# EAGLE design PowerMonitorV2 (EAGLE 8.6.0)
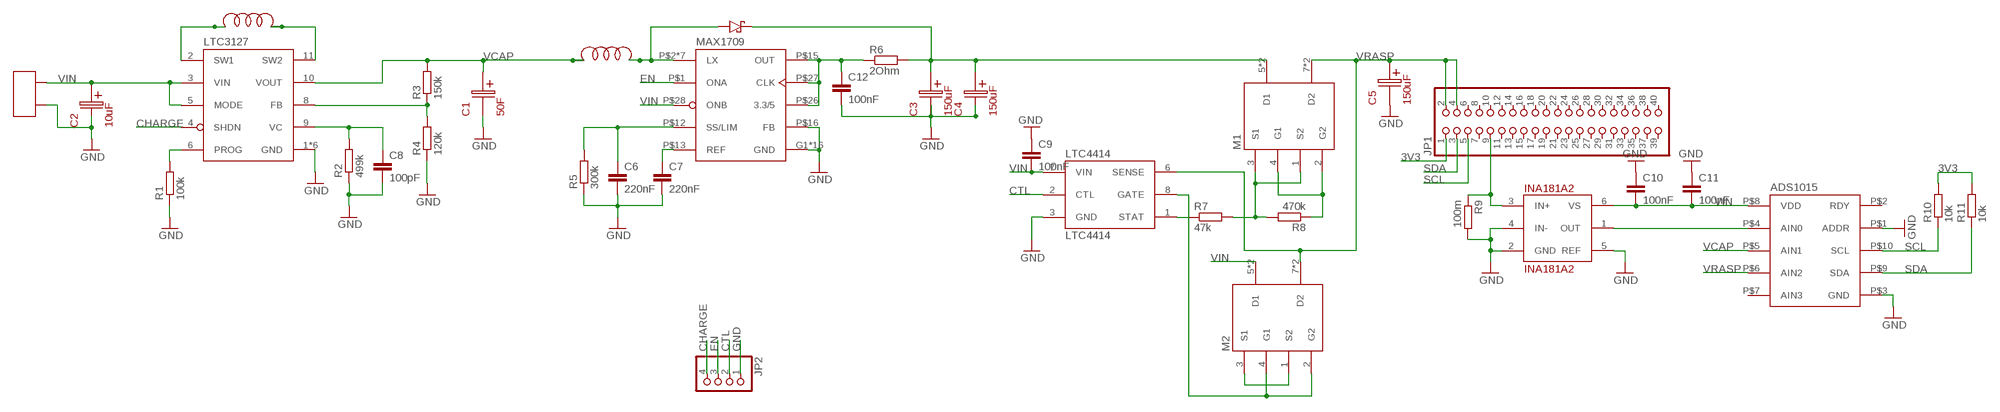
[diagram p0: schematic, sheet 1]

## Parts
ADS1015  ADS1015  [VSSOP-10]
C1  50F  CAPACITOR8MM50F_SUPERCAP  [CAP_RAD_8MM]
C2  10uF  CAPACITOR2.5MM  [CAP_RAD_2.5MM]
C3  150uF  CAPACITOR3.5MM  [CAP_RAD_3.5MM]
C4  150uF  CAPACITOR3.5MM  [CAP_RAD_3.5MM]
C5  150uF  CAPACITOR3.5MM  [CAP_RAD_3.5MM]
C6  220nF  C-EUC0805  [C0805]
C7  220nF  C-EUC0805  [C0805]
C8  100pF  C-EUC0805  [C0805]
C9  100nF  C-EUC0805  [C0805]
C10  100nF  C-EUC0805  [C0805]
C11  100nF  C-EUC0805  [C0805]
C12  100nF  C-EUC0805  [C0805]
CON1  TERM-2  [TERM-2]
D1  STPS8L30_DPAK  [DPAK]
INA181A2  INA181A2  [SOT-23-6]
JP1  PINHD-2X20  [2X20]
JP2  PINHD-1X4/90  [1X04/90]
L1  4.7uH  INDUCTOR6MM  [IND6X6]
L2  1uH  INDUCTOR6MM  [IND6X6]
LTC3127  LTC3127  [MS-12E2]
LTC4414  LTC4414  [MS8]
M1  IRF9358PBF  [SO-8]
M2  IRF9358PBF  [SO-8]
MAX1709  MAX1709  [TSSOP-EP28]
R1  100k  R-EU_R0805  [R0805]
R2  499k  R-EU_R0805  [R0805]
R3  150k  R-EU_R0805  [R0805]
R4  120k  R-EU_R0805  [R0805]
R5  300k  R-EU_R0805  [R0805]
R6  2Ohm  R-EU_R0805  [R0805]
R7  47k  R-EU_R0805  [R0805]
R8  470k  R-EU_R0805  [R0805]
R9  100m  R-EU_R0805  [R0805]
R10  10k  R-EU_R0805  [R0805]
R11  10k  R-EU_R0805  [R0805]

## Nets
3V3: JP1.1 R10.2 R11.2
BOOSTCAP: C3.VCAP(V+) C4.VCAP(V+) D1.P$1(CATHODE) D1.P$1_0(CATHODE) D1.P$1_1(CATHODE) D1.P$1_2(CATHODE) D1.P$1_3(CATHODE) D1.P$1_4(CATHODE) D1.P$1_5(CATHODE) D1.P$1_6(CATHODE) D1.P$1_7(CATHODE) D1.P$1_8(CATHODE) D1.P$1_9(CATHODE) M1.5(D1) M1.6(D1) R6.2
CHARGE: JP2.4 LTC3127.4(SHDN)
CTL: JP2.2 LTC4414.2(CTL)
EN: JP2.3 MAX1709.P$1(ONA)
GATECAP: M1.2(G2) M1.4(G1) R8.1
GATEVIN: LTC4414.8(GATE) M2.2(G2) M2.4(G1)
GND: ADS1015.P$1(ADDR) ADS1015.P$3(GND) C1.GND(V-) C2.GND(V-) C3.GND(V-) C4.GND(V-) C5.GND(V-) C6.2 C7.2 C8.2 C9.1 C10.1 C11.1 C12.2 CON1.2 INA181A2.2(GND) INA181A2.4(IN-) INA181A2.5(REF) JP2.1 LTC3127.1(GND) LTC3127.7(GND) LTC3127.12(GND) LTC3127.13_0(GND) LTC3127.13_1(GND) LTC3127.13_2(GND) LTC4414.3(GND) MAX1709.G1(GND) MAX1709.G2(GND) MAX1709.G3(GND) MAX1709.G4(GND) MAX1709.G5(GND) MAX1709.G6(GND) MAX1709.G7(GND) MAX1709.G8(GND) MAX1709.P$11(GND) MAX1709.P$14(GND) MAX1709.P$16(FB) MAX1709.P$18(GND) MAX1709.P$19(GND) MAX1709.P$20(GND) MAX1709.P$21(GND) MAX1709.P$22(GND) MAX1709.P$23(GND) R1.1 R2.1 R4.1 R5.1 R9.2
GNDPI: INA181A2.3(IN+) JP1.9 R9.1
N$1: C7.1 MAX1709.P$13(REF)
N$7: LTC3127.6(PROG) R1.2
N$9: C8.1 LTC3127.9(VC) R2.2
N$10: LTC3127.8(FB) R3.1 R4.2
N$12: M1.1(S2) M1.3(S1) R7.2 R8.2
N$13: C6.1 MAX1709.P$12(SS/LIM) R5.2
N$15: M2.1(S2) M2.3(S1)
N$19: C12.1 MAX1709.P$15(OUT) MAX1709.P$26(3.3/5) MAX1709.P$27(CLK) R6.1
N$22: LTC4414.1(STAT) R7.1
SCL: ADS1015.P$10(SCL) JP1.5 R10.1
SDA: ADS1015.P$9(SDA) JP1.3 R11.1
SW1_1: L1.P$1 L1.P$3 L1.P$4 LTC3127.2(SW1)
SW1_2: L1.P$2 L1.P$5 L1.P$6 LTC3127.11(SW2)
SW2: D1.P$2(ANODE) L2.P$2 L2.P$5 L2.P$6 MAX1709.P$2(LX) MAX1709.P$3(LX) MAX1709.P$4(LX) MAX1709.P$5(LX) MAX1709.P$6(LX) MAX1709.P$7(LX) MAX1709.P$8(LX)
VCAP: ADS1015.P$5(AIN1) C1.VCAP(V+) L2.P$1 L2.P$3 L2.P$4 LTC3127.10(VOUT) R3.2
VCURRENT: ADS1015.P$4(AIN0) INA181A2.1(OUT)
VIN: ADS1015.P$8(VDD) C2.VCAP(V+) C9.2 C10.2 C11.2 CON1.1 INA181A2.6(VS) LTC3127.3(VIN) LTC3127.5(MODE) LTC4414.7(VIN) M2.5(D1) M2.6(D1) MAX1709.P$28(ONB)
VRASP: ADS1015.P$6(AIN2) C5.VCAP(V+) JP1.2 JP1.4 LTC4414.6(SENSE) M1.7(D2) M1.8(D2) M2.7(D2) M2.8(D2)
Unconnected: ADS1015.P$2(RDY) ADS1015.P$7(AIN3) JP1.6 JP1.7 JP1.8 JP1.10 JP1.11 JP1.12 JP1.13 JP1.14 JP1.15 JP1.16 JP1.17 JP1.18 JP1.19 JP1.20 JP1.21 JP1.22 JP1.23 JP1.24 JP1.25 JP1.26 JP1.27 JP1.28 JP1.29 JP1.30 JP1.31 JP1.32 JP1.33 JP1.34 JP1.35 JP1.36 JP1.37 JP1.38 JP1.39 JP1.40

## Library data of the parts
ADS1015 = Thesis:ADS1015
C1 = Thesis:CAPACITOR8MM
C2 = Thesis:CAPACITOR2.5MM
C3-C5 = Thesis:CAPACITOR3.5MM
C6-C12 = rcl:C-EU: CAPACITOR, European symbol; SPICEPREFIX: C
CON1 = Thesis:TERM-2
D1 = Thesis:STPS8L30_DPAK
INA181A2 = Thesis:INA181A2
JP1 = pinhead:PINHD-2X20: PIN HEADER
JP2 = pinhead:PINHD-1X4: PIN HEADER
L1 L2 = Thesis:INDUCTOR6MM
LTC3127 = Thesis:LTC3127
LTC4414 = Thesis:LTC4414
M1 M2 = Thesis:IRF9358PBF
MAX1709 = Thesis:MAX1709
R1-R11 = rcl:R-EU_: RESISTOR, European symbol; SPICEPREFIX: R

## Board
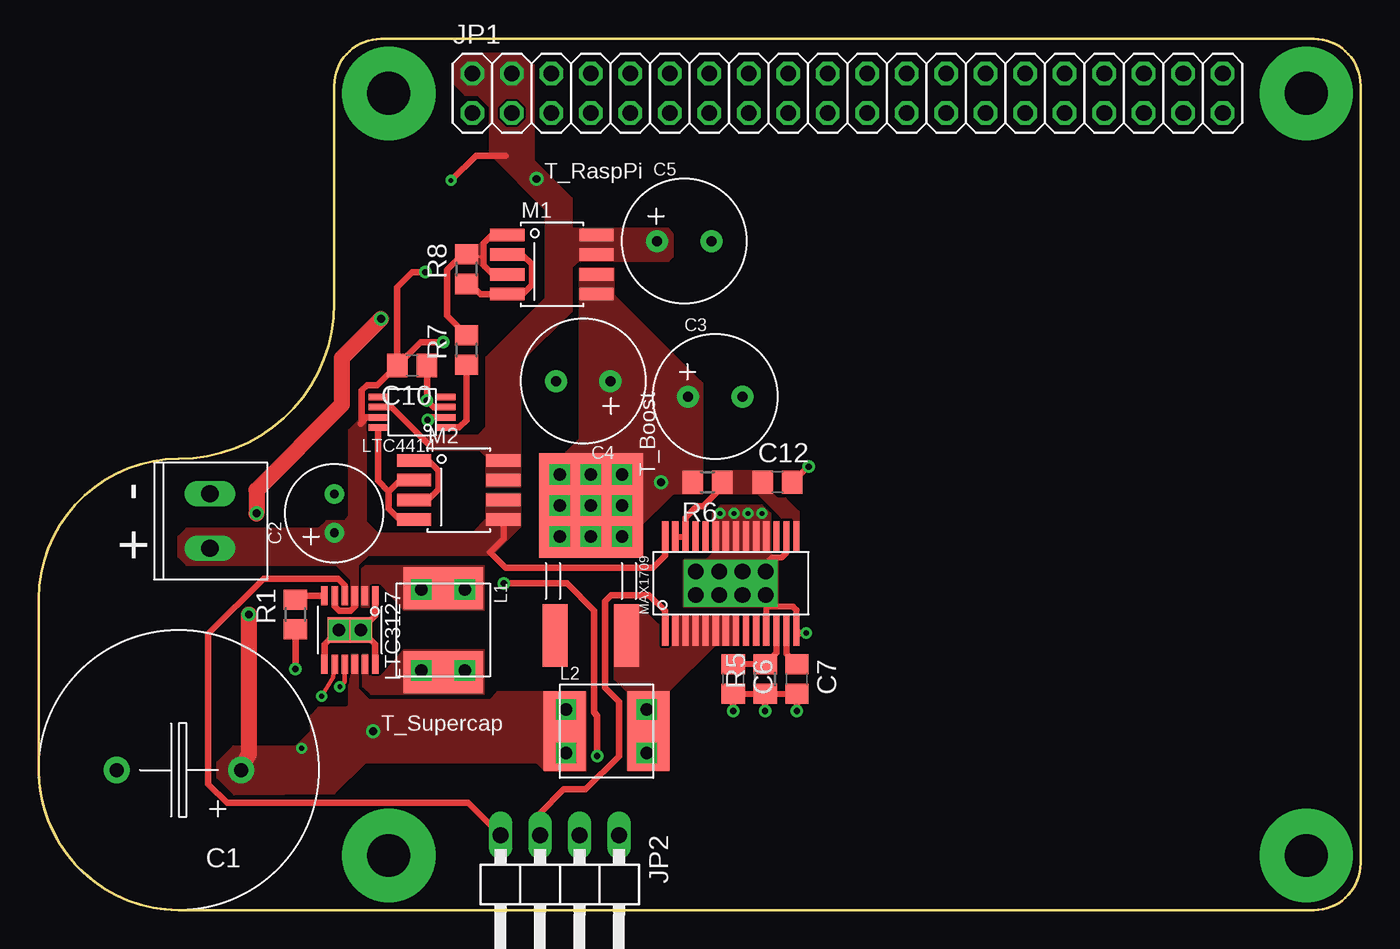
[diagram p1: board, top side]
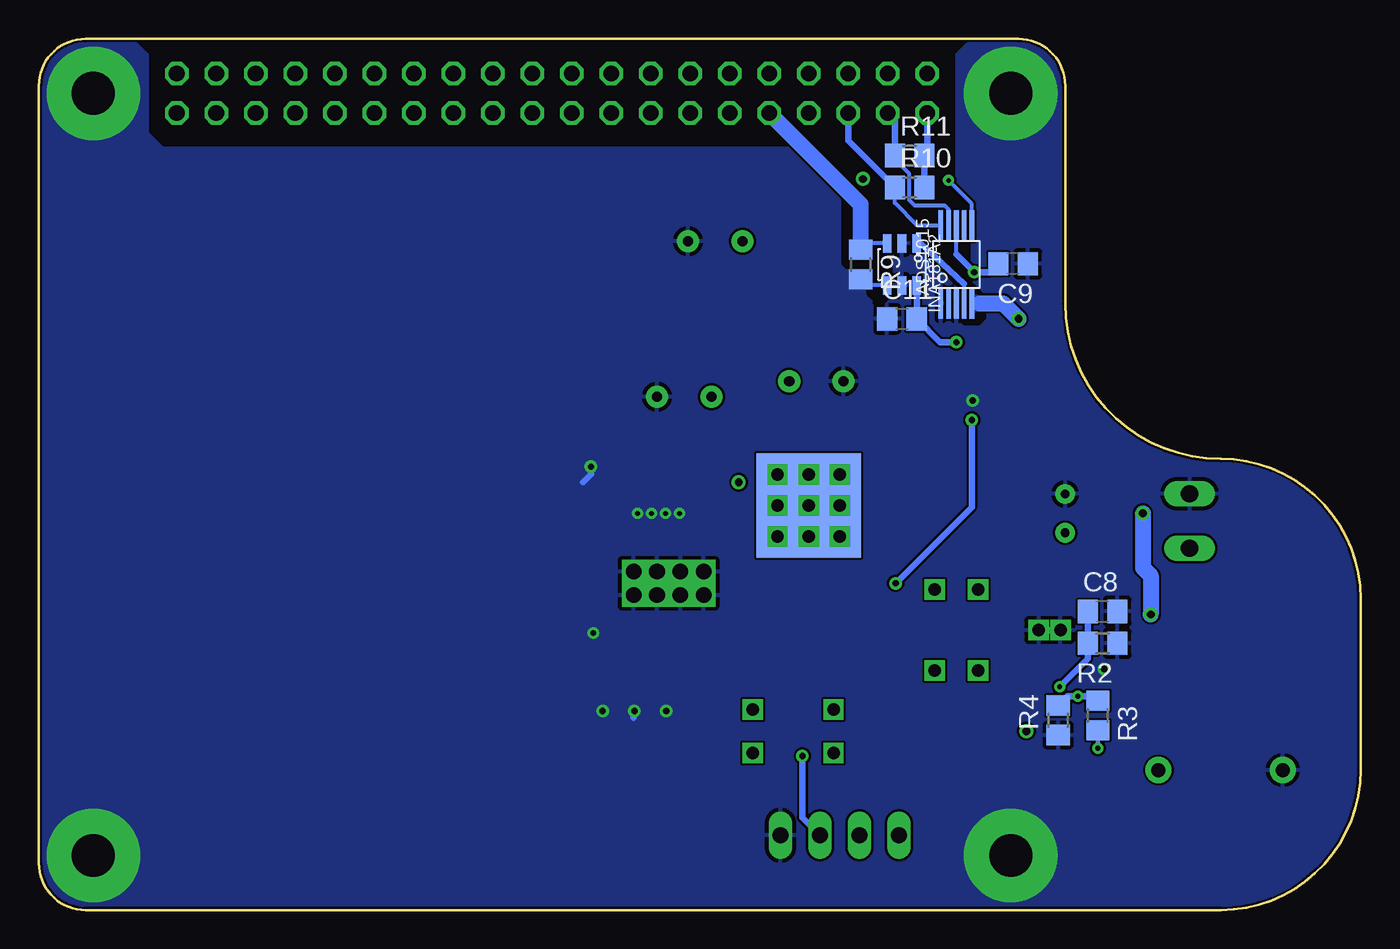
[diagram p2: board, bottom side, seen from below]

Size 85 x 56 mm. Coordinates in mm from the lower left corner, seen from the top.
Outline: 9,0 82,0 arc90 85,3 85,53 arc90 82,56 22,56 arc90 19,53 19,39 arc-90 9,29 arc90 0,20 0,9 arc90 9,0
Copper layers (1*16): Top 0.035mm / dielectric 1.5mm / Bottom 0.035mm
Design rules "PCBWay *": minimum track width 6mil, minimum drill 0.3mm, track to track 0.15mm, track to pad 0.15mm, pad to pad 0.15mm, via to via 0.15mm, smd to smd 0mil, copper to edge 6mil, drill to drill 6mil, minimum pad ring 10mil, minimum via ring 8mil, stop-mask expansion 4mil, vias tented up to drill 25mil, thermal gap 10mil

### Footprints (pad centres in the part's own frame; a part is rotated, then mirrored left to right if it is on the bottom)
VSSOP-10 = smd 2 x 0.3: P$1 -2.5,1; P$2 -2.5,0.5; P$3 -2.5,0; P$4 -2.5,-0.5; P$5 -2.5,-1; P$6 2.5,-1; P$7 2.5,-0.5; P$8 2.5,0; P$9 2.5,0.5; P$10 2.5,1
CAP_RAD_8MM = drill 0.9 pad 1.676: GND 4,0; VCAP -4,0
CAP_RAD_2.5MM = drill 0.55 pad 1.27: GND 1.25,0; VCAP -1.25,0
CAP_RAD_3.5MM = drill 0.65 pad 1.422: GND 1.75,0; VCAP -1.75,0
C0805 = smd 1.3 x 1.5: 1 -0.95,0; 2 0.95,0
TERM-2 = drill 1.1 long: 1 1.75,0; 2 -1.75,0
DPAK = smd 6.7 x 6.7: P$1 -3,0 | smd 6.7 x 6.7 bottom: P$1_0 -3,0 | drill 0.8 square: P$1_1 -5,2; P$1_2 -3,2; P$1_3 -1,2; P$1_4 -5,0; P$1_5 -3,0; P$1_6 -1,0; P$1_7 -5,-2; P$1_8 -3,-2; P$1_9 -1,-2 | smd 4 x 1.6: P$2 5.35,2.3; P$3 5.35,-2.3
SOT-23-6 = smd 0.55 x 1.2: 1 -0.95,-1.35; 2 0,-1.35; 3 0.95,-1.35; 4 0.95,1.35; 5 0,1.35; 6 -0.95,1.35
2X20 = drill 1.016 octagon: 1 -24.13,-1.27; 2 -24.13,1.27; 3 -21.59,-1.27; 4 -21.59,1.27; 5 -19.05,-1.27; 6 -19.05,1.27; 7 -16.51,-1.27; 8 -16.51,1.27; 9 -13.97,-1.27; 10 -13.97,1.27; 11 -11.43,-1.27; 12 -11.43,1.27; 13 -8.89,-1.27; 14 -8.89,1.27; 15 -6.35,-1.27; 16 -6.35,1.27; 17 -3.81,-1.27; 18 -3.81,1.27; 19 -1.27,-1.27; 20 -1.27,1.27; 21 1.27,-1.27; 22 1.27,1.27; 23 3.81,-1.27; 24 3.81,1.27; 25 6.35,-1.27; 26 6.35,1.27; 27 8.89,-1.27; 28 8.89,1.27; 29 11.43,-1.27; 30 11.43,1.27; 31 13.97,-1.27; 32 13.97,1.27; 33 16.51,-1.27; 34 16.51,1.27; 35 19.05,-1.27; 36 19.05,1.27; 37 21.59,-1.27; 38 21.59,1.27; 39 24.13,-1.27; 40 24.13,1.27
1X04/90 = drill 1.016 long: 1 -3.81,-3.81; 2 -1.27,-3.81; 3 1.27,-3.81; 4 3.81,-3.81
IND6X6 = smd 2.7 x 5.1: P$1 -2.7,0; P$2 2.7,0 | drill 0.8 square: P$3 -2.6,1.4; P$4 -2.6,-1.4; P$5 2.6,1.4; P$6 2.6,-1.4
MS-12E2 = smd 0.42 x 1.2: 1 -1.625,-2.2; 2 -0.975,-2.2; 3 -0.325,-2.2; 4 0.325,-2.2; 5 0.975,-2.2; 6 1.625,-2.2; 7 1.625,2.2; 8 0.975,2.2; 9 0.325,2.2; 10 -0.325,2.2; 11 -0.975,2.2; 12 -1.625,2.2 | smd 2.845 x 1.651: 13_0 0,0 | drill 0.8 square: 13_1 0.7,0; 13_2 -0.7,0
MS8 = smd 0.42 x 1.2: 1 -0.975,-2.2; 2 -0.325,-2.2; 3 0.325,-2.2; 4 0.975,-2.2; 5 0.975,2.2; 6 0.325,2.2; 7 -0.325,2.2; 8 -0.975,2.2
SO-8 = smd 0.8 x 2.2: 1 -1.905,-2.87; 2 -0.635,-2.87; 3 0.635,-2.87; 4 1.905,-2.87; 5 1.905,2.87; 6 0.635,2.87; 7 -0.635,2.87; 8 -1.905,2.87
TSSOP-EP28 = drill 1 pad 1.5 square: G1 -0.75,2.25; G2 0.75,2.25; G3 -0.75,0.75; G4 0.75,0.75; G5 -0.75,-0.75; G6 0.75,-0.75; G7 -0.75,-2.25; G8 0.75,-2.25 | smd 2 x 0.4: P$1 -3,4.225; P$2 -3,3.575; P$3 -3,2.925; P$4 -3,2.275; P$5 -3,1.625; P$6 -3,0.975; P$7 -3,0.325; P$8 -3,-0.325; P$9 -3,-0.975; P$10 -3,-1.625; P$11 -3,-2.275; P$12 -3,-2.925; P$13 -3,-3.575; P$14 -3,-4.225; P$15 3,-4.225; P$16 3,-3.575; P$17 3,-2.925; P$18 3,-2.275; P$19 3,-1.625; P$20 3,-0.975; P$21 3,-0.325; P$22 3,0.325; P$23 3,0.975; P$24 3,1.625; P$25 3,2.275; P$26 3,2.925; P$27 3,3.575; P$28 3,4.225
R0805 = smd 1.3 x 1.5: 1 -0.95,0; 2 0.95,0

### Placement (x,y rotation side)
ADS1015  26,41.5 90 bottom
C1  9,9 180 top
C2  19,25.5 90 top
C3  43.5,33 0 top
C4  35,34 180 top
C5  41.5,43 0 top
C6  44.65,14.85 270 top
C7  48.75,14.85 270 top
C8  16.6,19.2 0 bottom
C9  22.35,41.55 180 bottom
C10  24,35 180 top
C11  29.5,38 0 bottom
C12  47.5,27.5 0 top
CON1  11,25 270 top
D1  35.5,23 270 top
INA181A2  29.5,41.5 180 bottom
JP1  52,52.5 0 top
JP2  33.5,1 180 top
L1  26,18 270 top
L2  36.5,11.5 0 top
LTC3127  20,18 180 top
LTC4414  24,32 90 top
M1  33,41.5 270 top
M2  27,27 270 top
MAX1709  44.5,21 90 top
R1  16.5,19 90 top
R2  16.6,17.15 180 bottom
R3  16.9,12.5 270 bottom
R4  19.45,12.2 90 bottom
R5  46.7,14.85 90 top
R6  43,27.5 180 top
R7  27.5,36 90 top
R8  27.5,41.2 90 top
R9  32.15,41.5 270 bottom
R10  29,46.45 0 bottom
R11  29,48.5 0 bottom

### Tracks (layer width: path | path; a pad name or v marks a point on that pad's centre or on a via)
3V3
  Bottom 0.42: JP1.1 27.87,48.68 R11.2 R10.2
BOOSTCAP  (via drill 0.5)
  Top 1.016: D1.P$1_5 D1.P$1_4 | D1.P$1_5 D1.P$1_3 | D1.P$1_5 D1.P$1_9 | D1.P$1_5 D1.P$1_8 | D1.P$1_5 D1.P$1_7 | D1.P$1_5 D1.P$1_6
  other vias: 40,27.5
  pour Top (no thermals): 34.8,39.2 34.8,41.25 36.95,41.25 36.95,39.2
  pour Top (no thermals): 33.5,29 34.8,30.3 34.8,39.9 36.95,39.9 36.95,39.55 42.5,34 42.65,33.85 42.65,26.8 40.8,26.8 38.5,24.5 38,24.5
CHARGE
  Top 0.42: JP2.4 27.6,6.9 12.1,6.9 10.9,8.1 10.9,17.75 14.45,21.3 19.25,21.3 19.68,20.88 LTC3127.4
CTL  (via drill 0.4)
  Top 0.42: LTC4414.2 25.18,31.68 v25,31.5 | v29.9,21 33.95,21 35.7,19.25 35.7,12.7 35.9,12.5 v35.9,9.9
  Bottom 0.42: v25,31.5 25,25.9 v29.9,21 | v35.9,9.9 35.9,5.94 JP2.2
EN
  Top 0.42: MAX1709.P$1 40.27,19.23 39.25,20.25 36.8,20.25 36.4,19.85 36.4,14.3 37.3,13.4 37.3,9.9 35.15,7.75 33.75,7.75 32.23,6.23 JP2.3
GATECAP
  Top 0.42: M1.2 31.07,42.13 31.7,41.5 31.7,40.2 31.09,39.59 M1.4 28.41,39.59 27.75,40.25 R8.1
GATEVIN
  Top 0.42: M2.4 23.2,25.09 22.5,25.8 22.5,26.9 | 22.5,26.9 23.23,27.64 M2.2 | LTC4414.8 21.8,27.6 22.5,26.9
GND  (via drill 0.3, 0.35, 0.4, 2.75 pad 6)
  Top 0.305: LTC3127.13_0 LTC3127.13_2
  Top 0.4: MAX1709.P$11 46.77,19.5 | 46.77,19.5 46.77,20.23 MAX1709.G7 | C6.2 R5.1 C7.2 | MAX1709.P$16 48.08,22.95 47.77,22.65 47.15,22.65 46.75,22.25 MAX1709.G8 | MAX1709.P$14 48.73,19.27 48.5,19.5 46.77,19.5
  Top 0.42: LTC3127.7 18.38,17.07 LTC3127.13_1 19.02,18.27 | LTC3127.1 21.62,18.93 LTC3127.13_2 21.62,17.07 LTC3127.12 | C12.2 49.45,28.5 v49.5,28.5 | C7.2 v48.75,12.8 | C6.2 v44.65,12.8 | R5.1 v46.7,12.8 | LTC4414.3 25.38,32.33 v24.95,32.75 C10.1 | R1.1 v16.5,15.5 | MAX1709.P$14 48.92,17.8 v49.35,17.8
  Bottom 0.254: INA181A2.4 31.75,40.15 R9.2
  Bottom 0.42: v49.5,28.5 49.5,28 50,27.5 | v46.7,12.8 46.75,12.35 | LTC3127.13_2 LTC3127.13_1
  other vias: 22.5,52.5 81.5,52.5 22.5,3.5 81.5,3.5 43.8,25.5 44.7,25.5 45.6,25.5 46.5,25.5
  pour Top (no thermals): 47.5,19.5 47.5,22.5 47,23 47,25.5 46.5,26 43.85,26 43.35,25.5 43.35,22.95 42.9,22.5 41.5,22.5 41.5,19.5
  pour Bottom: -1,56.5 24.5,56.5 26,55 26,46.5 25,45.5 25,40.5 24,39.5 24,38 24.5,37.5 25.5,37.5 26,38 26,40 29,43 29.5,43 30,42.5 30,39.5 31,38.5 31.5,39 32.5,40.5 33.5,41.5 33.5,48 34.5,49 77,49 78,50 78,55 79.5,56.5 86.5,56.5 86.5,-1 -1,-1
  pour Bottom (no thermals): 31.5,39 32,39.5 32,40 32.5,40.5 32.5,41 33.5,41 33.5,39
GNDPI
  Bottom 0.254: INA181A2.3 31.75,42.85 R9.1
  Bottom 1.016: R9.1 32.15,45.35 JP1.9
N$1
  Top 0.42: MAX1709.P$13 48.08,16.48 C7.1
N$7
  Top 0.42: LTC3127.6 16.75,20.2 R1.2
N$9  (via drill 0.3)
  Top 0.305: LTC3127.9 19.68,14.68 v19.35,14.35
  Bottom 0.42: C8.1 R2.2 17.55,16.15 v19.35,14.35
N$10  (via drill 0.3)
  Top 0.305: LTC3127.8 18.93,14.97 v18.19,13.74
  Bottom 0.305: 17.44,13.74 R3.1
  Bottom 0.42: 17.44,13.74 v18.19,13.74 18.86,13.74 R4.2
N$12
  Top 0.15: R8.2 27.65,42 28.6,42
  Top 0.42: M1.3 29.18,40.87 28.6,41.45 28.6,42 28.6,42.85 29.16,43.41 M1.1 | R8.2 27.25,42.15 26.25,41.15 26.25,38.2 R7.2
  pour Top (no thermals): 28.15,42.7 28.25,42.7 28.55,43 28.55,41.3 28.15,41.7
N$13
  Top 0.4: R5.2 C6.1
  Top 0.42: R5.2 47.42,16.52 MAX1709.P$12
N$15
  Top 0.42: M2.3 25.02,26.36 25.7,27.05 25.7,28.25 25.05,28.91 M2.1
N$19
  Top 0.4: MAX1709.P$27 MAX1709.P$26
  Top 0.42: R6.1 43.95,27.2 42.7,25.95 42.3,25.95 41.58,25.23 MAX1709.P$26
  pour Top (no thermals): 43.35,28.2 47.15,28.2 47.15,26.8 47.5,26.45 48,26.45 48.85,25.6 48.85,24.95 48.6,24.95 48.6,25.1 48.45,25.25 47.75,25.25 46.2,26.8 43.35,26.8
N$22
  Top 0.42: LTC4414.1 27.02,31.02 27.5,31.5 R7.1
SCL
  Bottom 0.254: ADS1015.P$10 28.5,44 29.95,45.45 R10.1
  Bottom 0.42: R10.1 32.95,49.45 JP1.5
SDA
  Bottom 0.254: ADS1015.P$9 26.5,45.04 26.73,45.28 28.67,45.28 29.02,45.63 29.02,47.31 29.95,48.24 R11.1
  Bottom 0.42: R11.1 29.95,50.77 JP1.3
SW1_1
  pour Top (no thermals): 20.8,19.5 21.2,19.5 21.2,21 22,21 23.5,19.3 28.6,19.3 28.6,22.1 21,22.1 20.8,21.9
SW1_2
  pour Top (no thermals): 21.15,16.4 21.15,15 22,15 23.5,16.7 28.6,16.7 28.6,13.9 21.35,13.9 20.85,14.4 20.85,16.4
SW2
  pour Top (no thermals): 37.9,9 37.9,14 37.05,14.85 37.05,19.6 38.55,19.6 39.8,18.35 39.8,16.95 40,16.75 40.55,16.75 40.8,17 40.8,18.95 44.95,18.95 44.95,17.05 43.5,17.05 40.5,14.05 40.5,9
VCAP  (via drill 0.3, 0.5)
  Top 1.016: v14,25.5 14,27 19.5,32.5 19.5,35.5 v22,38 | v13.5,19 13.5,10 C1.VCAP
  Bottom 0.305: ADS1015.P$5 24.5,39 | R3.2 v16.9,10.4
  Bottom 1.016: 24.5,39 23,39 v22,38 | v14,25.5 14,22 13.5,21.5 v13.5,19
  other vias: 21.5,11.5
  pour Top (no thermals): 20.15,16.4 20.5,16.4 20.5,14.25 21.25,13.5 29,13.5 29.5,14 35.15,14 35.15,8.95 32.55,8.95 32,9.5 21,9.5 19,7.5 12.55,7.45 11.5,8.5 11.5,9.5 12.5,10.5 16.5,10.5 17.5,11.5 17.5,12.5 18,13 19.8,13 19.95,13.15 19.95,14.5 20.15,15.15
  pour Bottom (no thermals): 24.35,38.6 24.9,38.45 24.9,39.55 24.35,39.4
VCURRENT
  Bottom 0.254: 25.5,40.25 ADS1015.P$4
  Bottom 0.42: INA181A2.1 28.3,42.85 25.5,40.25
VIN  (via drill 0.4)
  Top 0.42: MAX1709.P$28 40.27,22.77 39.5,22 30,22 29,23 29.87,23.87 M2.5 | LTC4414.7 21.07,31.68 20.7,31.25 20.75,31.3 20.75,33.4 21.1,33.75 21.75,33.75 23,35 C10.2 | C10.2 23.05,40.05 24,41 v24.85,41 | C10.2 23.94,35.89 23.94,35.9 24.54,36.5 v26,36.5 | LTC3127.5 19.02,19.53 19.32,19.24 20.03,19.24 20.32,19.53 LTC3127.3
  Bottom 0.254: 26,42.15 ADS1015.P$8
  Bottom 0.42: INA181A2.6 C11.2 27.05,36.5 v26,36.5 | 26,42.15 v24.85,41 23.85,41 C9.2
  pour Top (no thermals): 20.1,19.6 20.5,19.6 20.5,26 19.7,25 18.5,25 18,24.5 9.5,24.5 9,24 9,22.7 9.5,22.2 19.1,22.2 20.1,21.2
  pour Top (no thermals): 28.8,24.7 28.8,26.75 30.95,26.75 30.95,24.7
  pour Top (no thermals): 20.4,22 20.5,22.15 21.2,22.85 29.15,22.85 30.95,24.65 30.95,25.15 28.8,25.15 27.85,24.2 20.3,24.2 20.1,22
  pour Top (no thermals): 20.95,31.45 21,31.4 21,25 22,24 22,23.5 20.95,23.75 19.95,23.8 19.95,30.85 20.9,31.8 21.2,31.8
VRASP  (via drill 0.3, 0.5)
  Top 0.42: LTC4414.6 22.68,32.33 25,30 | v26.5,46.9 28.1,48.5 30,48.5
  Bottom 0.254: ADS1015.P$6 25,45.4 v26.5,46.9
  other vias: 32,47
  pour Top (no thermals): 34.8,41.75 34.8,43.8 40.45,43.8 40.75,43.45 40.75,42 40.5,41.75
  pour Top (no thermals): 28.8,27.2 28.8,29.25 30.95,29.25 30.95,27.2
  pour Top (no thermals): 28.8,29.25 28.8,35.55 32.6,39.35 32.6,42.6 33.8,43.8 35.2,43.8 35.25,41.75 34.7,41.75 34.25,41.35 34.25,38.5 30.95,35.2 30.95,29 29.05,29
  pour Top: 32.6,42.5 34.25,41.1 34,41.1
  pour Top (no thermals): 29.4,28.55 28.35,29.6 25.2,29.6 24.3,30.5 28.25,30.5 28.9,31.15 28.95,31.1
  pour Top (no thermals): 32.6,42.6 32.6,45 29,48.6 29,51.6 28.2,52.4 27.4,52.4 26.6,53.2 26.6,54.4 27.25,55.05 31.05,55.05 31.8,54.3 31.8,48.2 34.25,45.75 34.25,41.2 34,41.2

### Text on the board
tPlace: T_RaspPi | - | T_Boost | + | T_Supercap